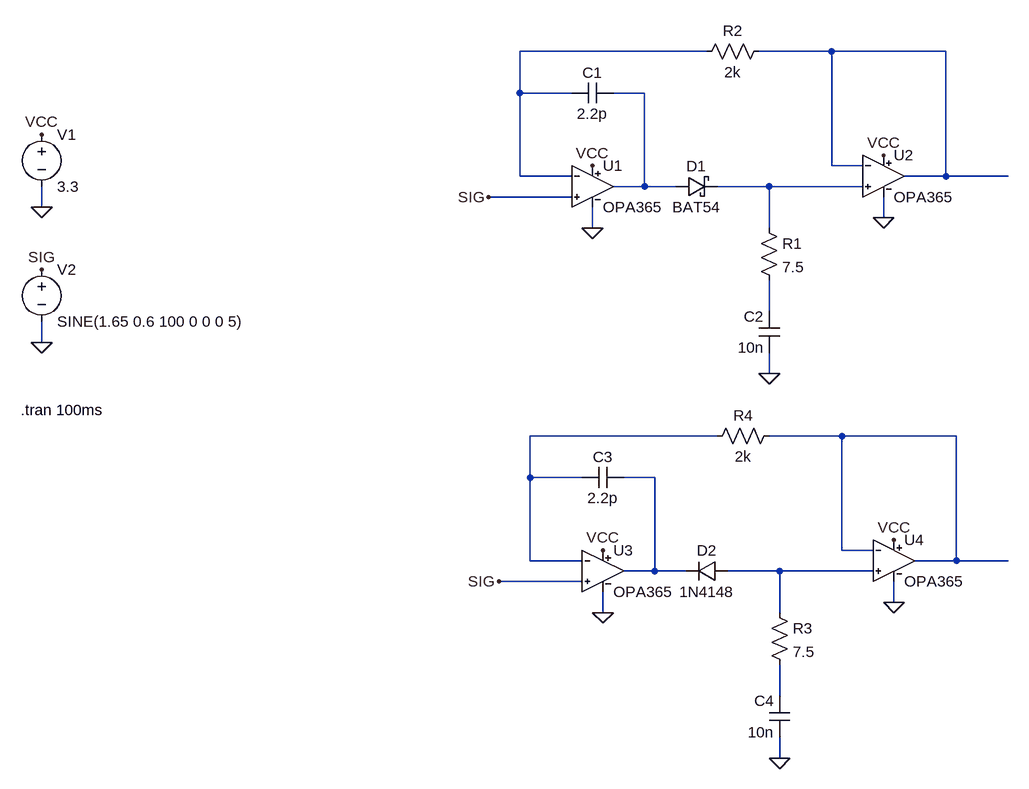
[diagram p0: schematic Peak det_bidir4.asc]
Peak det_bidir4.asc, the LTspice schematic file:
Version 4
SHEET 1 1232 900
WIRE 448 -208 160 -208
WIRE 640 -208 528 -208
WIRE 816 -208 640 -208
WIRE 160 -144 160 -208
WIRE 240 -144 160 -144
WIRE 352 -144 304 -144
WIRE 640 -32 640 -208
WIRE 688 -32 640 -32
WIRE 160 -16 160 -144
WIRE 240 -16 160 -16
WIRE 816 -16 816 -208
WIRE 816 -16 752 -16
WIRE 912 -16 816 -16
WIRE 352 0 352 -144
WIRE 352 0 304 0
WIRE 400 0 352 0
WIRE 544 0 464 0
WIRE 688 0 544 0
WIRE 240 16 112 16
WIRE -576 32 -576 0
WIRE 720 48 720 16
WIRE 272 64 272 32
WIRE 544 64 544 0
WIRE 544 192 544 144
WIRE -576 240 -576 208
WIRE 544 288 544 256
WIRE 464 384 176 384
WIRE 656 384 544 384
WIRE 832 384 656 384
WIRE 176 448 176 384
WIRE 256 448 176 448
WIRE 368 448 320 448
WIRE 656 560 656 384
WIRE 704 560 656 560
WIRE 176 576 176 448
WIRE 256 576 176 576
WIRE 832 576 832 384
WIRE 832 576 768 576
WIRE 912 576 832 576
WIRE 368 592 368 448
WIRE 368 592 320 592
WIRE 416 592 368 592
WIRE 560 592 480 592
WIRE 704 592 560 592
WIRE 256 608 128 608
WIRE 736 640 736 608
WIRE 288 656 288 624
WIRE 560 656 560 592
WIRE 560 784 560 736
WIRE 560 880 560 848
FLAG 544 288 0
FLAG -576 32 0
FLAG -576 240 0
FLAG -576 -80 VCC
FLAG 272 -32 VCC
FLAG -576 128 SIG
FLAG 720 -48 VCC
FLAG 112 16 SIG
FLAG 560 880 0
FLAG 288 560 VCC
FLAG 736 544 VCC
FLAG 128 608 SIG
FLAG 272 64 0
FLAG 720 48 0
FLAG 736 640 0
FLAG 288 656 0
SYMBOL voltage -576 -96 R0
WINDOW 123 0 0 Left 0
WINDOW 39 0 0 Left 0
SYMATTR InstName V1
SYMATTR Value 3.3
SYMBOL voltage -576 112 R0
WINDOW 123 0 0 Left 0
WINDOW 39 0 0 Left 0
SYMATTR InstName V2
SYMATTR Value SINE(1.65 0.6 100 0 0 0 5)
SYMBOL cap 304 -160 R90
WINDOW 0 0 32 VBottom 2
WINDOW 3 32 32 VTop 2
SYMATTR InstName C1
SYMATTR Value 2.2p
SYMBOL cap 560 256 R180
WINDOW 0 24 56 Left 2
WINDOW 3 24 8 Left 2
SYMATTR InstName C2
SYMATTR Value 10n
SYMBOL res 528 48 R0
SYMATTR InstName R1
SYMATTR Value 7.5
SYMBOL res 544 -224 R90
WINDOW 0 0 56 VBottom 2
WINDOW 3 32 56 VTop 2
SYMATTR InstName R2
SYMATTR Value 2k
SYMBOL Lib_01\\OPA365 272 -64 R0
SYMATTR InstName U1
SYMBOL Lib_01\\OPA365 720 -80 R0
SYMATTR InstName U2
SYMBOL cap 320 432 R90
WINDOW 0 0 32 VBottom 2
WINDOW 3 32 32 VTop 2
SYMATTR InstName C3
SYMATTR Value 2.2p
SYMBOL cap 576 848 R180
WINDOW 0 24 56 Left 2
WINDOW 3 24 8 Left 2
SYMATTR InstName C4
SYMATTR Value 10n
SYMBOL res 544 640 R0
SYMATTR InstName R3
SYMATTR Value 7.5
SYMBOL res 560 368 R90
WINDOW 0 0 56 VBottom 2
WINDOW 3 32 56 VTop 2
SYMATTR InstName R4
SYMATTR Value 2k
SYMBOL diode 480 576 R90
WINDOW 0 0 32 VBottom 2
WINDOW 3 32 32 VTop 2
SYMATTR InstName D2
SYMATTR Value 1N4148
SYMBOL Lib_01\\OPA365 288 528 R0
SYMATTR InstName U3
SYMBOL Lib_01\\OPA365 736 512 R0
SYMATTR InstName U4
SYMBOL schottky 400 16 R270
WINDOW 0 32 32 VTop 2
WINDOW 3 0 32 VBottom 2
SYMATTR InstName D1
SYMATTR Value BAT54
SYMATTR Description Diode
SYMATTR Type diode
TEXT -608 344 Left 2 !.tran 100ms

The netlist it stands for:
* Peak det_bidir4.asc
V1 VCC 0 3.3
V2 SIG 0 SINE(1.65 0.6 100 0 0 0 5)
C1 N003 N001 2.2p
C2 0 N005 10n
R1 N004 N005 7.5
R2 N002 N001 2k
XU1 SIG N001 VCC 0 N003 OPA365  ; pins 3 4 5 2 1
XU2 N004 N002 VCC 0 N002 OPA365  ; pins 3 4 5 2 1
C3 N008 N006 2.2p
C4 0 N010 10n
R3 N009 N010 7.5
R4 N007 N006 2k
D2 N009 N008 1N4148
XU3 SIG N006 VCC 0 N008 OPA365  ; pins 3 4 5 2 1
XU4 N009 N007 VCC 0 N007 OPA365  ; pins 3 4 5 2 1
D1 N003 N004 BAT54
.model D D
.lib standard.dio
.tran 100ms
.lib OPA365.lib
.backanno
.end